# Altium schematic sheet Sheet2.SchDoc
size A4; SheetNumber: 1; SheetTotal: 5
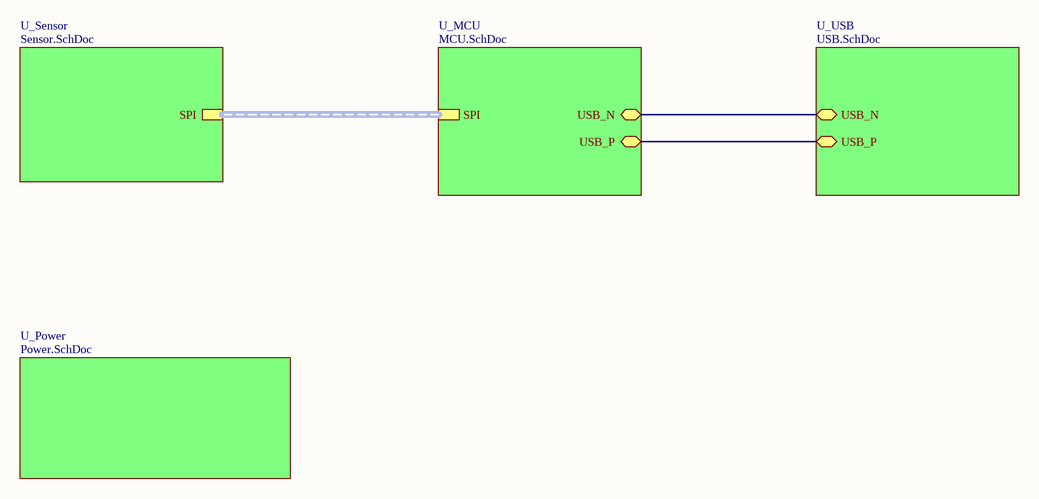
[diagram p0: Sheet2.SchDoc]

## Sub-sheets
U_MCU = MCU.SchDoc: SPI (harness SPI), USB_N (bidir), USB_P (bidir)
U_Power = Power.SchDoc: no entries
U_Sensor = Sensor.SchDoc: SPI (harness *)
U_USB = USB.SchDoc: USB_N (bidir), USB_P (bidir)

## Nets
(unnamed): sheet U_MCU/USB_N, sheet U_USB/USB_N
(unnamed): sheet U_MCU/USB_P, sheet U_USB/USB_P

## Buses and harness runs
harness sheet U_MCU/SPI = sheet U_Sensor/SPI